# EAGLE design BrushBotComm_A1 (EAGLE 5.07)
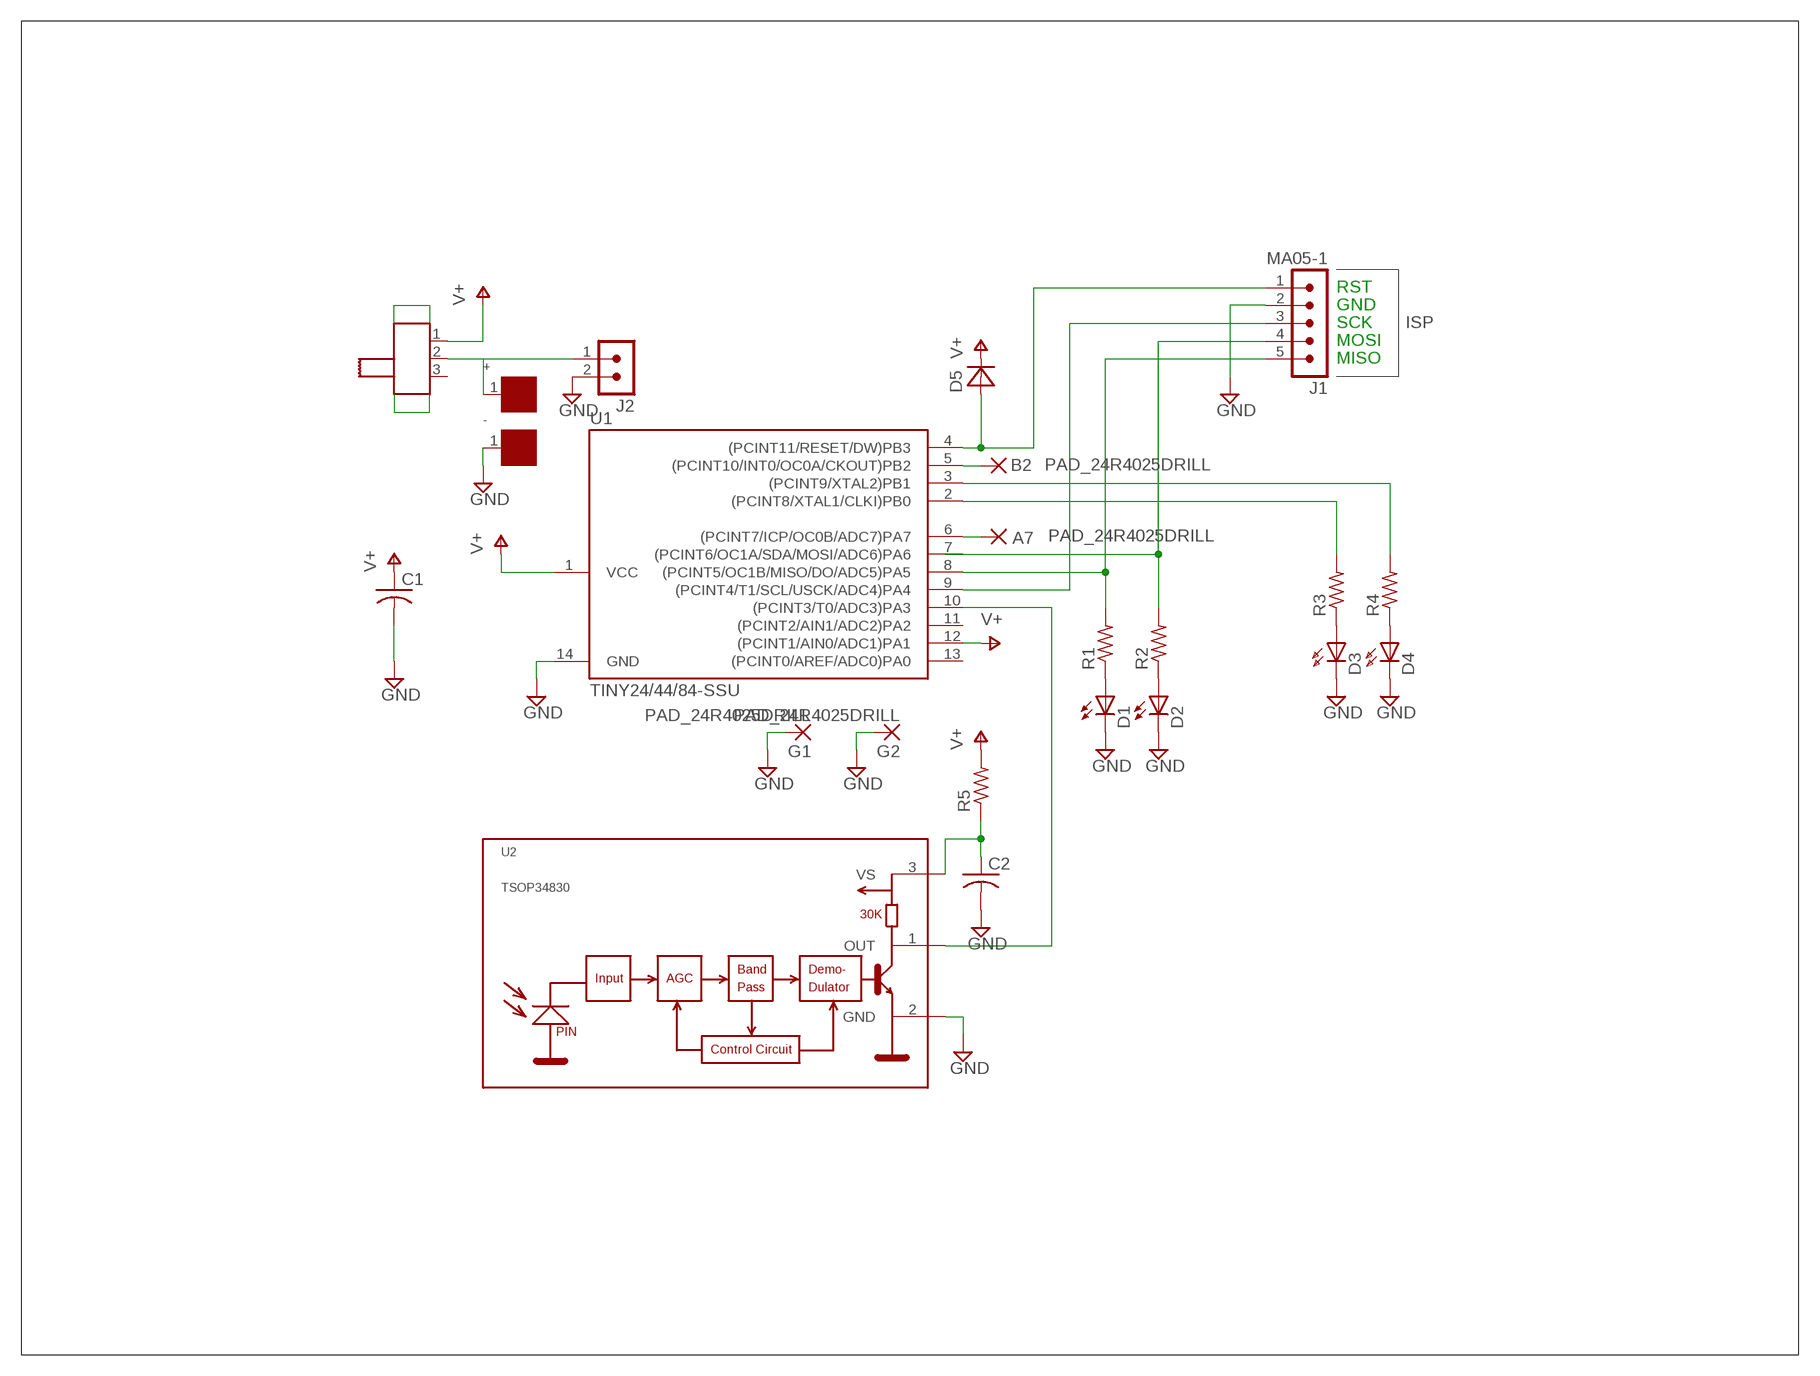
[diagram p0: schematic, sheet 1]

## Parts
+  BATTERM4X4MM  [BATTERM]
-  BATTERM4X4MM  [BATTERM]
A7  PAD_24R4025DRILL  [25R40]
B2  PAD_24R4025DRILL  [25R40]
C1  C-USC0603  [C0603]
C2  C-USC1206  [C1206]
D1  LEDIRL80A  [IRL80A]
D2  LEDIRL80A  [IRL80A]
D3  LED603  [LED603]
D4  LED603  [LED603]
D5  DIODE-SOD323-RE  [SOD323-R]
G1  PAD_24R4025DRILL  [25R40]
G2  PAD_24R4025DRILL  [25R40]
J1  MA05-1  MA05-1OCTPADS-25DRILL  [MA05O-1-25]
J2  MA02-1OCTPADS-25  [MA02O-1-25]
PWR  SSSS8  [SSSS8]
R1  R-US_R0603  [R0603]
R2  R-US_R0603  [R0603]
R3  R-US_R0603  [R0603]
R4  R-US_R0603  [R0603]
R5  R-US_R0603  [R0603]
U1  TINY24/44/84-SSU  [SOIC14]
U2  TSOP34830  [TSOP348]

## Nets
GND: -.1 C1.2 C2.2 D1.K(C) D2.K(C) D3.C D4.C G1.1(P) G2.1(P) J1.2 J2.2 U1.14(GND) U2.2(GND)
N$1: D1.A R1.1
N$2: D2.A R2.1
N$3: J1.4 R2.2 U1.7((PCINT6/OC1A/SDA/MOSI/ADC6)PA6)
N$4: J1.5 R1.2 U1.8((PCINT5/OC1B/MISO/DO/ADC5)PA5)
N$5: U1.10((PCINT3/T0/ADC3)PA3) U2.1(OUT)
N$6: R3.2 U1.2((PCINT8/XTAL1/CLKI)PB0)
N$7: R4.2 U1.3((PCINT9/XTAL2)PB1)
N$8: D3.A R3.1
N$9: D4.A R4.1
N$10: J1.3 U1.9((PCINT4/T1/SCL/USCK/ADC4)PA4)
N$11: D5.A J1.1 U1.4((PCINT11/RESET/DW)PB3)
N$12: C2.1 R5.1 U2.3(VS)
N$13: +.1 J2.1 PWR.2
N$14: PWR.G3 PWR.G4
N$15: PWR.G1 PWR.G2
N$16: B2.1(P) U1.5((PCINT10/INT0/OC0A/CKOUT)PB2)
N$17: A7.1(P) U1.6((PCINT7/ICP/OC0B/ADC7)PA7)
V+: C1.1 D5.C PWR.1 R5.2 U1.1(VCC) U1.12((PCINT1/AIN0/ADC1)PA1)
Unconnected: PWR.3 U1.11((PCINT2/AIN1/ADC2)PA2) U1.13((PCINT0/AREF/ADC0)PA0)

## Notes on the sheet
- RST
- GND
- SCK | ISP
- MOSI
- MISO

## Library data of the parts
+ - = battery_keystone:BATTERM: PCB button cell terminal
A7 B2 G1 G2 = my_wirepad:PAD_24R40
C1 C2 = my_rcl:C-US: CAPACITOR, American symbol
D1 D2 = led:LED: LED OSRAM: - CHIPLED LG R971, LG N971, LY N971, LG Q971, LY Q971, LO R971, LY R971 LH N974, LH R974 LS Q976, LO Q976, LY Q976 LO Q996 - Hyper CHIPLED LW Q18S LB Q993, LB Q99A, LB R99A - SideLED LS A670, LO A670, LY A670, LG A670, LP A670 LB A673, LV A673, LT A673, LW A673 LH A674 LY A675 LS A676, LA A676, LO A676, LY A676, LW A676 LS A679, LY A679, LG A679 - Hyper Micro SIDELED® LS Y876, LA Y876, LO Y876, LY Y876 LT Y87S - SmartLED LW L88C, LW L88S LB L89C, LB L89S, LG L890 LS L89K, LO L89K, LY L89K LS L896, LA L896, LO L896, LY L896 - TOPLED LS T670, LO T670, LY T670, LG T670, LP T670 LSG T670, LSP T670, LSY T670, LOP T670, LYG T670 LG T671, LOG T671, LSG T671 LB T673, LV T673, LT T673, LW T673 LH T674 LS T676, LA T676, LO T676, LY T676, LB T676, LH T676, LSB T676, LW T676 LB T67C, LV T67C, LT T67C, LS T67K, LO T67K, LY T67K, LW E67C LS E67B, LA E67B, LO E67B, LY E67B, LB E67C, LV E67C, LT E67C LW T67C LS T679, LY T679, LG T679 LS T770, LO T770, LY T770, LG T770, LP T770 LB T773, LV T773, LT T773, LW T773 LH T774 LS E675, LA E675, LY E675, LS T675 LS T776, LA T776, LO T776, LY T776, LB T776 LHGB T686 LT T68C, LB T68C - Hyper Mini TOPLED® LB M676 - Mini TOPLED Santana® LG M470 LS M47K, LO M47K, LY M47K Source: http://www.osram.convergy.de LUXEON: - LUMILED® LXK2-PW12-R00, LXK2-PW12-S00, LXK2-PW14-U00, LXK2-PW14-V00 LXK2-PM12-R00, LXK2-PM12-S00, LXK2-PM14-U00 LXK2-PE12-Q00, LXK2-PE12-R00, LXK2-PE12-S00, LXK2-PE14-T00, LXK2-PE14-U00 LXK2-PB12-K00, LXK2-PB12-L00, LXK2-PB12-M00, LXK2-PB14-N00, LXK2-PB14-P00, LXK2-PB14-Q00 LXK2-PR12-L00, LXK2-PR12-M00, LXK2-PR14-Q00, LXK2-PR14-R00 LXK2-PD12-Q00, LXK2-PD12-R00, LXK2-PD12-S00 LXK2-PH12-R00, LXK2-PH12-S00 LXK2-PL12-P00, LXK2-PL12-Q00, LXK2-PL12-R00 Source: www.luxeon.com KINGBRIGHT: KA-3528ASYC Source: www.kingbright.com
D3 D4 = my_led:LED603: Thin 603 LED Lite-ON
D5 = my_diode:DIODE-: DIODE
J1 = my_con:MA05-1: 5x1 Pin 0.05" spacing Male Header
J2 = my_con:MA02-1: 0.050" 2-pin header
PWR = microSwitch:SSSS8: ALPS SSSS811101 Miniature SPST side slide switch Also: COPAL CUS-12TB Also: C&K PCM12SMTR
R1-R5 = my_rcl:R-US_: RESISTOR, American symbol
U1 = avr-6:TINY24/44/84
U2 = vishay-1:TSOP348*: IR Receiver Modules for Remote Control Systems http://www.vishay.com/ir-receiver-modules/

## Board
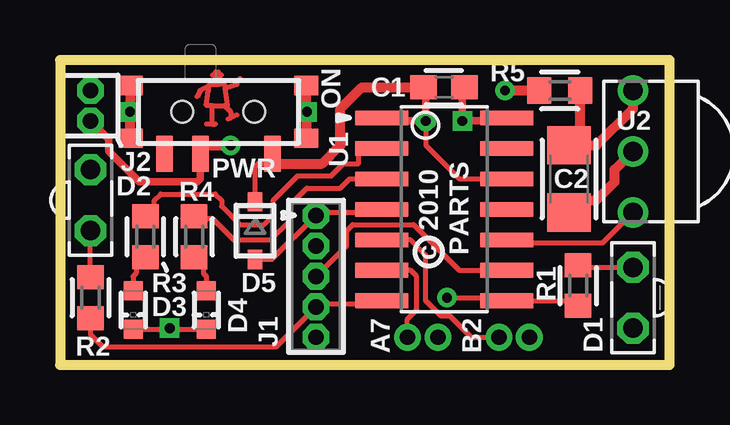
[diagram p1: board, top side]
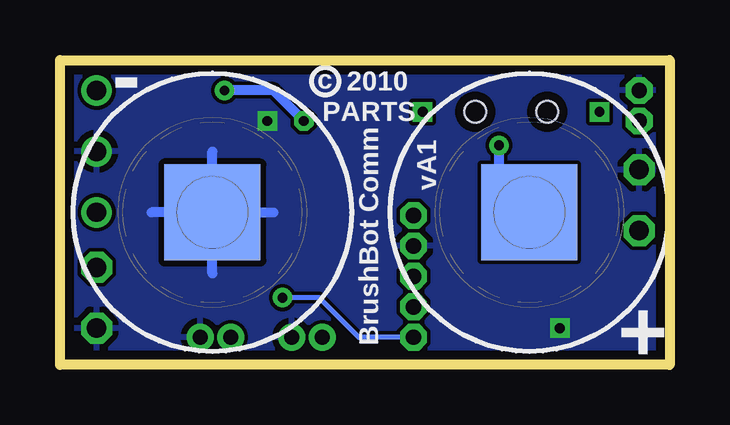
[diagram p2: board, bottom side, seen from below]

Size 25.4 x 12.7 mm. Coordinates in mm from the lower left corner, seen from the top.
Outline: 0,0 25.4,0 25.4,12.7 0,12.7 0,0
Copper layers (1*16): Top 0.0356mm / dielectric 1.5011mm / Bottom 0.0356mm
Design rules "LaenPCBOrder *": minimum track width 6mil, minimum drill 13mil, track to track 6mil, track to pad 6mil, pad to pad 6mil, via to via 6mil, smd to smd 6mil, copper to edge 15mil, drill to drill 6mil, minimum pad ring 9.5mil, minimum via ring 8mil, stop-mask expansion 4mil, vias tented up to drill 0mil, thermal gap 10mil

### Footprints (pad centres in the part's own frame; a part is rotated, then mirrored left to right if it is on the bottom)
BATTERM = smd 4 x 4: 1 0,0
25R40 = drill 0.635 round: 1 0,0
C0603 = smd 1.1 x 1: 1 -0.85,0; 2 0.85,0
C1206 = smd 1.6 x 1.8: 1 -1.4,0; 2 1.4,0
IRL80A = drill 0.813 octagon: A 0,-1.27; K 0,1.27
LED603 = smd 0.8 x 0.8: A -0.8,0; C 0.8,0
SOD323-R = smd 0.8 x 0.6: A 1.2,0; C -1.2,0
MA05O-1-25 = drill 0.635 pad 1.016 octagon: 1 -2.54,0; 2 -1.27,0; 3 0,0; 4 1.27,0; 5 2.54,0
MA02O-1-25 = drill 0.635 octagon: 1 -1.27,0; 2 0,0
SSSS8 = smd 0.7 x 1.5: 1 -2.25,1.75; 2 0.75,1.75; 3 2.25,1.75 | smd 1 x 0.8: G1 -3.65,1.1; G2 -3.65,-1.1; G3 3.65,-1.1; G4 3.65,1.1 | hole 0.9: -1.5,0; 1.5,0
R0603 = smd 1 x 1.1: 1 -0.85,0; 2 0.85,0
SOIC14 = smd 0.61 x 2.21: 1 -3.81,-2.603; 2 -2.54,-2.603; 3 -1.27,-2.603; 4 0,-2.603; 5 1.27,-2.603; 6 2.54,-2.603; 7 3.81,-2.603; 8 3.81,2.603; 9 2.54,2.603; 10 1.27,2.603; 11 0,2.603; 12 -1.27,2.603; 13 -2.54,2.603; 14 -3.81,2.603
TSOP348 = drill 0.8 round: 1 -2.54,0; 2 0,0; 3 2.54,0

### Placement (x,y rotation side)
+  5.84,6.35 0 bottom
-  19.05,6.35 0 bottom
A7  14.48,1.14 0 top
B2  18.29,1.14 0 top
C1  16,11.56 0 top
C2  21.21,7.75 270 top
D1  23.88,2.79 180 top
D2  1.27,6.86 0 top
D3  3.05,2.29 270 top
D4  6.1,2.29 270 top
D5  8.13,5.59 270 top
G1  15.75,1.14 0 top
G2  19.56,1.14 0 top
J1  10.67,3.68 270 top
J2  1.27,11.43 90 top
PWR  6.6,10.54 180 top
R1  21.59,3.3 270 top
R2  1.27,2.79 270 top
R3  3.56,5.33 90 top
R4  5.59,5.33 90 top
R5  20.83,11.43 180 top
U1  16,6.48 270 top
U2  23.88,8.89 90 top
U$1  [CHASSIS]  12.7,6.35 0 top

### Tracks (layer width: path | path; a pad name or v marks a point on that pad's centre or on a via)
GND  (via drill 0.41)
  Top 0.203: D3.C 4.53,1.49 v4.57,1.52 4.61,1.49 D4.C
  Top 0.305: C1.2 16.76,11.43 16.75,11.42 v16.75,10.16 v16.76,10.16 17.91,10.16 17.91,10.29 U1.14
  Top 0.406: C2.2 21.21,6.86 22.35,6.86 23.11,7.62 23.11,8.13 U2.2
  Bottom 0.406: -.1 16.51,6.35 | -.1 19.05,8.89 | -.1 21.59,6.35 | 19.05,3.81 -.1
  pour Bottom: 0,0 25.4,0 25.4,12.7 0,12.7
N$1
  Top 0.203: D1.A 21.59,4.06 R1.1
N$2
  Top 0.203: R2.1 D2.A
N$3
  Top 0.203: U1.7 12.83,2.54 10.67,2.54 J1.4 9.02,0.76 1.78,0.76 1.27,1.27 R2.2
N$4  (via drill 0.41)
  Top 0.203: R1.2 21.59,2.67 U1.8 17.78,2.67 17.78,2.79 v16.13,2.79
  Bottom 0.203: v16.13,2.79 14.61,2.79 12.95,1.14 J1.5
N$5
  Top 0.203: U1.10 19.3,5.21 19.3,5.08 22.61,5.08 U2.1
N$6
  Top 0.203: R3.2 3.94,6.44 3.94,6.86 4.19,7.11 6.48,7.11 6.73,6.86 6.73,6.6 7.49,5.84 8.51,5.84 8.89,6.22 8.89,6.86 9.91,7.87 11.3,7.87 11.81,8.38 12.45,8.38 12.45,9.02 U1.2
N$7
  Top 0.203: R4.2 5.59,6.1 6.35,6.1 7.24,5.21 8.76,5.21 9.53,5.97 9.53,6.6 10.29,7.37 11.68,7.37 12.06,7.75 U1.3
N$8
  Top 0.203: D3.A 3.05,3.68 3.17,3.81 3.17,4.36 R3.1
N$9
  Top 0.203: D4.A 6.1,3.68 5.97,3.81 5.97,4.36 R4.1
N$10
  Top 0.203: U1.9 16.64,3.94 14.73,5.84 12.19,5.84 11.94,5.59 11.94,4.95 J1.3
N$11
  Top 0.203: U1.4 12.7,6.35 10.79,6.35 J1.1 8.83,4.39 D5.A
N$12
  Top 0.406: R5.1 21.68,9.15 C2.1 22.35,9.14 23.88,10.67 U2.3
N$13  (via drill 0.41)
  Top 0.305: J2.1 2.03,9.4 2.03,8.89 3.3,7.62 5.71,7.62 5.85,7.76 PWR.2
  Top 0.406: v7.11,9.14 6.21,9.14 arc90 PWR.2
  Bottom 0.406: +.1 7.11,6.35 v7.11,9.14
N$14  (via drill 0.41)
  Top 0.406: PWR.G4 2.92,9.47 v2.92,10.54 2.95,10.57 PWR.G3
N$15  (via drill 0.41)
  Top 0.406: PWR.G1 10.29,9.47 v10.29,10.54 10.25,10.57 PWR.G2
N$16
  Top 0.203: U1.5 14.61,5.21 15.24,4.57 15.24,2.67 15.88,2.03 16.26,2.03 17.14,1.14 B2.1
N$17
  Top 0.203: U1.6 14.61,3.94 14.86,3.68 14.86,2.29 14.48,1.91 A7.1
N$22
  Top 0.203: 6.35,10.79 6.1,10.79 6.18,11.42 | 6.35,10.79 6.86,10.79 | 6.86,10.79 6.99,10.79 6.88,11.52 | 6.88,11.52 6.86,11.68 6.6,11.68 | 6.48,11.68 6.6,11.68 | 6.48,11.68 6.22,11.68 6.18,11.42 | 6.35,10.03 6.35,10.79 | 6.35,10.03 6.1,10.03 | 6.35,10.03 6.48,10.03 | 6.86,10.79 7.11,10.54 7.11,10.29 | 7.11,10.29 7.01,10.24 | 7.11,10.29 7.37,10.41 | 6.48,11.68 6.48,12.06 | 6.48,12.06 6.48,12.19 6.6,12.19 6.6,11.68 | 5.71,11.18 5.84,11.43 6.1,11.56 6.18,11.47 6.18,11.42 | 7.49,11.94 7.37,11.68 6.99,11.56 6.88,11.52 | 6.48,12.06 6.73,12.06 | 6.48,12.06 6.35,12.06
V+  (via drill 0.41)
  Top 0.203: D5.C 8.13,8.26 8.26,8.38 8.85,8.38 | U1.12 16.64,7.75 15.24,9.14 v15.24,10.16
  Top 0.305: U1.1 13.97,10.29 13.97,10.16 v15.24,10.16 15.24,11.32 C1.1
  Top 0.406: PWR.1 8.85,8.38 10.92,8.38 11.68,9.14 11.68,10.67 12.57,11.56 C1.1 | v18.54,11.43 R5.2
  Bottom 0.406: v18.54,11.43 16.51,11.43 v15.24,10.16

### Text on the board
tNames: ON | 2010 | PARTS | c
bNames: c | 2010 | BrushBot Comm | PARTS | vA1
Measures: 1.0" | 0.5"